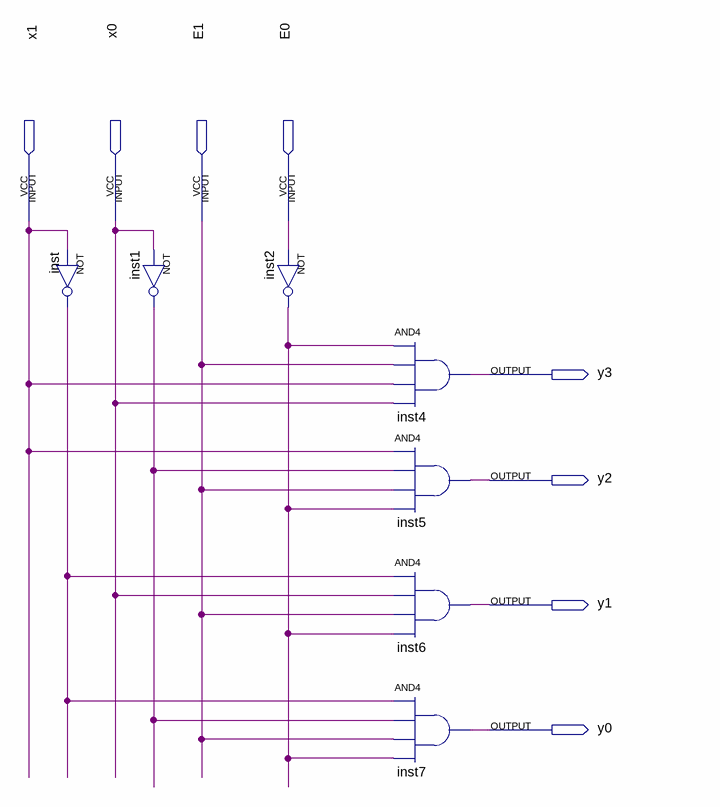
[diagram p0: schematic sheet]
// Quartus schematic decod2to4.bdf as structural Verilog: 7 symbols, 8 pins
module decod2to4 (
  input  x1,
  input  x0,
  input  E1,
  input  E0,
  output y3,
  output y2,
  output y1,
  output y0
);

  wire inst1_out, inst2_out, inst_out;

  not inst (inst_out, x1);
  not inst1 (inst1_out, x0);
  not inst2 (inst2_out, E0);
  and inst4 (y3, inst2_out, E1, x1, x0);
  and inst5 (y2, x1, inst1_out, E1, inst2_out);
  and inst6 (y1, inst_out, x0, E1, inst2_out);
  and inst7 (y0, inst_out, inst1_out, E1, inst2_out);
endmodule
